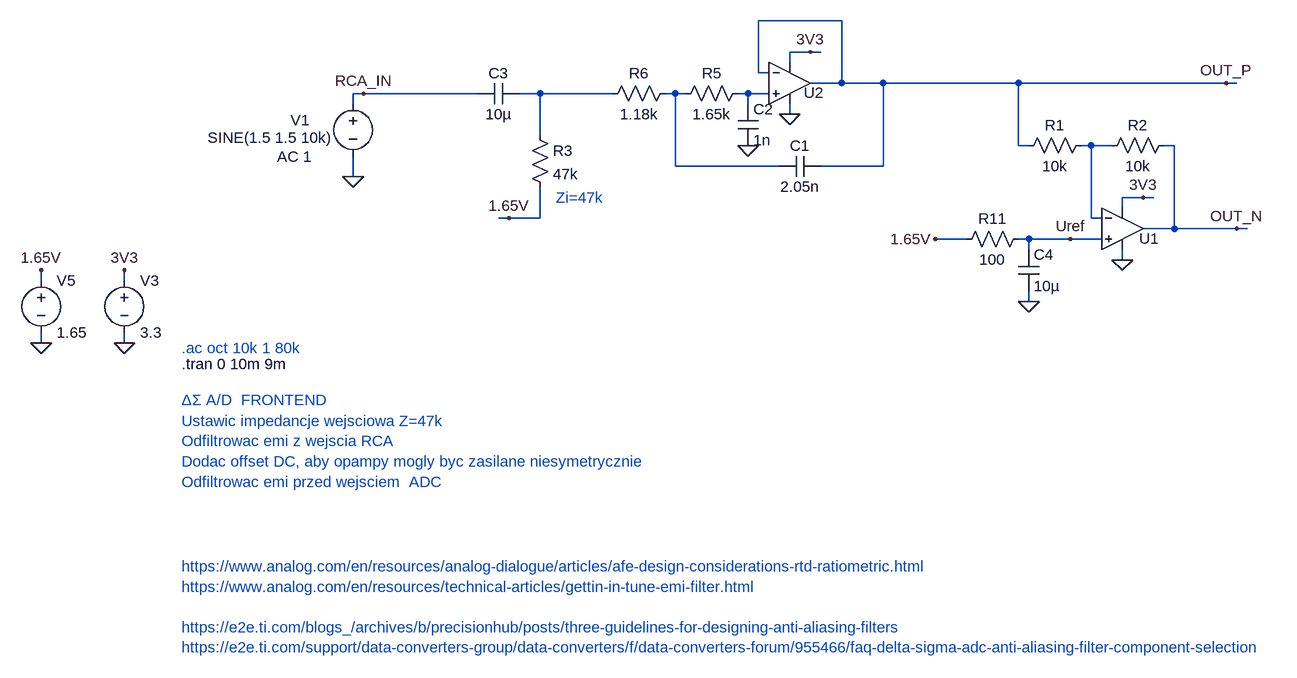
[diagram p0: schematic adc_frontend.asc]
adc_frontend.asc, the LTspice schematic file:
Version 4
SHEET 1 6576 10088
WIRE 896 -96 768 -96
WIRE 848 -48 816 -48
WIRE 864 -48 848 -48
WIRE 816 -32 816 -48
WIRE 768 -16 768 -96
WIRE 784 -16 768 -16
WIRE 896 0 896 -96
WIRE 896 0 848 0
WIRE 960 0 896 0
WIRE 1168 0 960 0
WIRE 1488 0 1168 0
WIRE 1504 0 1488 0
WIRE 160 16 144 16
WIRE 336 16 160 16
WIRE 432 16 400 16
WIRE 544 16 432 16
WIRE 640 16 624 16
WIRE 656 16 640 16
WIRE 752 16 736 16
WIRE 784 16 752 16
WIRE 144 32 144 16
WIRE 752 32 752 16
WIRE 816 48 816 32
WIRE 432 80 432 16
WIRE 1168 96 1168 0
WIRE 1184 96 1168 96
WIRE 1280 96 1264 96
WIRE 1312 96 1280 96
WIRE 1408 96 1392 96
WIRE 640 128 640 16
WIRE 800 128 640 128
WIRE 960 128 960 0
WIRE 960 128 864 128
WIRE 144 144 144 112
WIRE 1360 176 1328 176
WIRE 1376 176 1360 176
WIRE 1328 192 1328 176
WIRE 384 208 368 208
WIRE 432 208 432 160
WIRE 432 208 384 208
WIRE 1280 208 1280 96
WIRE 1296 208 1280 208
WIRE 1408 224 1408 96
WIRE 1408 224 1360 224
WIRE 1504 224 1408 224
WIRE 1520 224 1504 224
WIRE 1088 240 1040 240
WIRE 1184 240 1168 240
WIRE 1248 240 1184 240
WIRE 1296 240 1248 240
WIRE 1184 256 1184 240
WIRE 1328 272 1328 256
WIRE -336 304 -336 288
WIRE -208 304 -208 288
WIRE 1184 336 1184 320
WIRE -336 400 -336 384
WIRE -208 400 -208 384
FLAG -208 288 3V3
FLAG -208 400 0
FLAG 144 144 0
FLAG 160 16 RCA_IN
FLAG 816 48 0
FLAG 848 -48 3V3
FLAG 1488 0 OUT_P
FLAG 1328 272 0
FLAG 1504 224 OUT_N
FLAG 1360 176 3V3
FLAG 752 96 0
FLAG 1040 240 1.65V
FLAG 1184 336 0
FLAG -336 288 1.65V
FLAG -336 400 0
FLAG 1248 240 Uref
FLAG 384 208 1.65V
SYMBOL voltage -208 288 R0
WINDOW 123 0 0 Left 0
WINDOW 39 0 0 Left 0
SYMATTR InstName V3
SYMATTR Value 3.3
SYMBOL voltage 144 16 R0
WINDOW 0 -96 41 Left 2
WINDOW 3 -224 68 Left 2
WINDOW 123 -117 97 Left 2
WINDOW 39 0 0 Left 0
SYMATTR InstName V1
SYMATTR Value SINE(1.5 1.5 10k)
SYMATTR Value2 AC 1
SYMBOL cap 400 0 R90
WINDOW 0 0 32 VBottom 2
WINDOW 3 32 32 VTop 2
SYMATTR InstName C3
SYMATTR Value 10µ
SYMBOL res 416 64 R0
SYMATTR InstName R3
SYMATTR Value 47k
SYMBOL OpAmps\\UniversalOpAmp 816 0 R0
WINDOW 0 22 15 Left 2
SYMATTR InstName U2
SYMBOL OpAmps\\UniversalOpAmp 1328 224 R0
WINDOW 0 26 15 Left 2
SYMATTR InstName U1
SYMBOL res 1280 80 R90
WINDOW 0 0 56 VBottom 2
WINDOW 3 32 56 VTop 2
SYMATTR InstName R1
SYMATTR Value 10k
SYMBOL res 1408 80 R90
WINDOW 0 0 56 VBottom 2
WINDOW 3 32 56 VTop 2
SYMATTR InstName R2
SYMATTR Value 10k
SYMBOL res 752 0 R90
WINDOW 0 0 56 VBottom 2
WINDOW 3 32 56 VTop 2
SYMATTR InstName R5
SYMATTR Value 1.65k
SYMBOL res 640 0 R90
WINDOW 0 0 56 VBottom 2
WINDOW 3 32 56 VTop 2
SYMATTR InstName R6
SYMATTR Value 1.18k
SYMBOL cap 864 112 R90
WINDOW 0 0 32 VBottom 2
WINDOW 3 32 32 VTop 2
SYMATTR InstName C1
SYMATTR Value 2.05n
SYMBOL cap 736 32 R0
SYMATTR InstName C2
SYMATTR Value 1n
SYMBOL cap 1168 256 R0
SYMATTR InstName C4
SYMATTR Value 10µ
SYMBOL res 1184 224 R90
WINDOW 0 0 56 VBottom 2
WINDOW 3 32 56 VTop 2
SYMATTR InstName R11
SYMATTR Value 100
SYMBOL voltage -336 288 R0
WINDOW 123 0 0 Left 0
WINDOW 39 0 0 Left 0
SYMATTR InstName V5
SYMATTR Value 1.65
TEXT -120 432 Left 2 !.tran 0 10m 9m
TEXT -120 408 Left 2 ;.ac oct 10k 1 80k
TEXT -120 488 Left 2 ;ΔΣ A/D  FRONTEND
TEXT -120 520 Left 2 ;Ustawic impedancje wejsciowa Z=47k\nOdfiltrowac emi z wejscia RCA\nDodac offset DC, aby opampy mogly byc zasilane niesymetrycznie\nOdfiltrowac emi przed wejsciem  ADC
TEXT 456 176 Left 2 ;Zi=47k
TEXT -120 744 Left 2 ;https://www.analog.com/en/resources/analog-dialogue/articles/afe-design-considerations-rtd-ratiometric.html\nhttps://www.analog.com/en/resources/technical-articles/gettin-in-tune-emi-filter.html\n \nhttps://e2e.ti.com/blogs_/archives/b/precisionhub/posts/three-guidelines-for-designing-anti-aliasing-filters\nhttps://e2e.ti.com/support/data-converters-group/data-converters/f/data-converters-forum/955466/faq-delta-sigma-adc-anti-aliasing-filter-component-selection

The netlist it stands for:
* adc_frontend.asc
V3 3V3 0 3.3
V1 RCA_IN 0 SINE(1.5 1.5 10k) AC 1
C3 N001 RCA_IN 10µ
R3 N001 1.65V 47k
XU2 N003 OUT_P 3V3 0 OUT_P level1 Avol=1Meg GBW=10Meg Vos=0 En=0 Enk=0 In=0 Ink=0 Rin=500Meg  ; pins In+ In- V+ V- OUT
XU1 Uref N004 3V3 0 OUT_N level1 Avol=1Meg GBW=10Meg Vos=0 En=0 Enk=0 In=0 Ink=0 Rin=500Meg  ; pins In+ In- V+ V- OUT
R1 N004 OUT_P 10k
R2 OUT_N N004 10k
R5 N003 N002 1.65k
R6 N002 N001 1.18k
C1 OUT_P N002 2.05n
C2 N003 0 1n
C4 Uref 0 10µ
R11 Uref 1.65V 100
V5 1.65V 0 1.65
.tran 0 10m 9m
* .ac oct 10k 1 80k
* ΔΣ A/D  FRONTEND
* Ustawic impedancje wejsciowa Z=47k
* Odfiltrowac emi z wejscia RCA
* Dodac offset DC, aby opampy mogly byc zasilane niesymetrycznie
* Odfiltrowac emi przed wejsciem  ADC
* Zi=47k
* https://www.analog.com/en/resources/analog-dialogue/articles/afe-design-considerations-rtd-ratiometric.html
* https://www.analog.com/en/resources/technical-articles/gettin-in-tune-emi-filter.html
* https://e2e.ti.com/blogs_/archives/b/precisionhub/posts/three-guidelines-for-designing-anti-aliasing-filters
* https://e2e.ti.com/support/data-converters-group/data-converters/f/data-converters-forum/955466/faq-delta-sigma-adc-anti-aliasing-filter-component-selection
.lib UniversalOpAmp1.lib
.backanno
.end